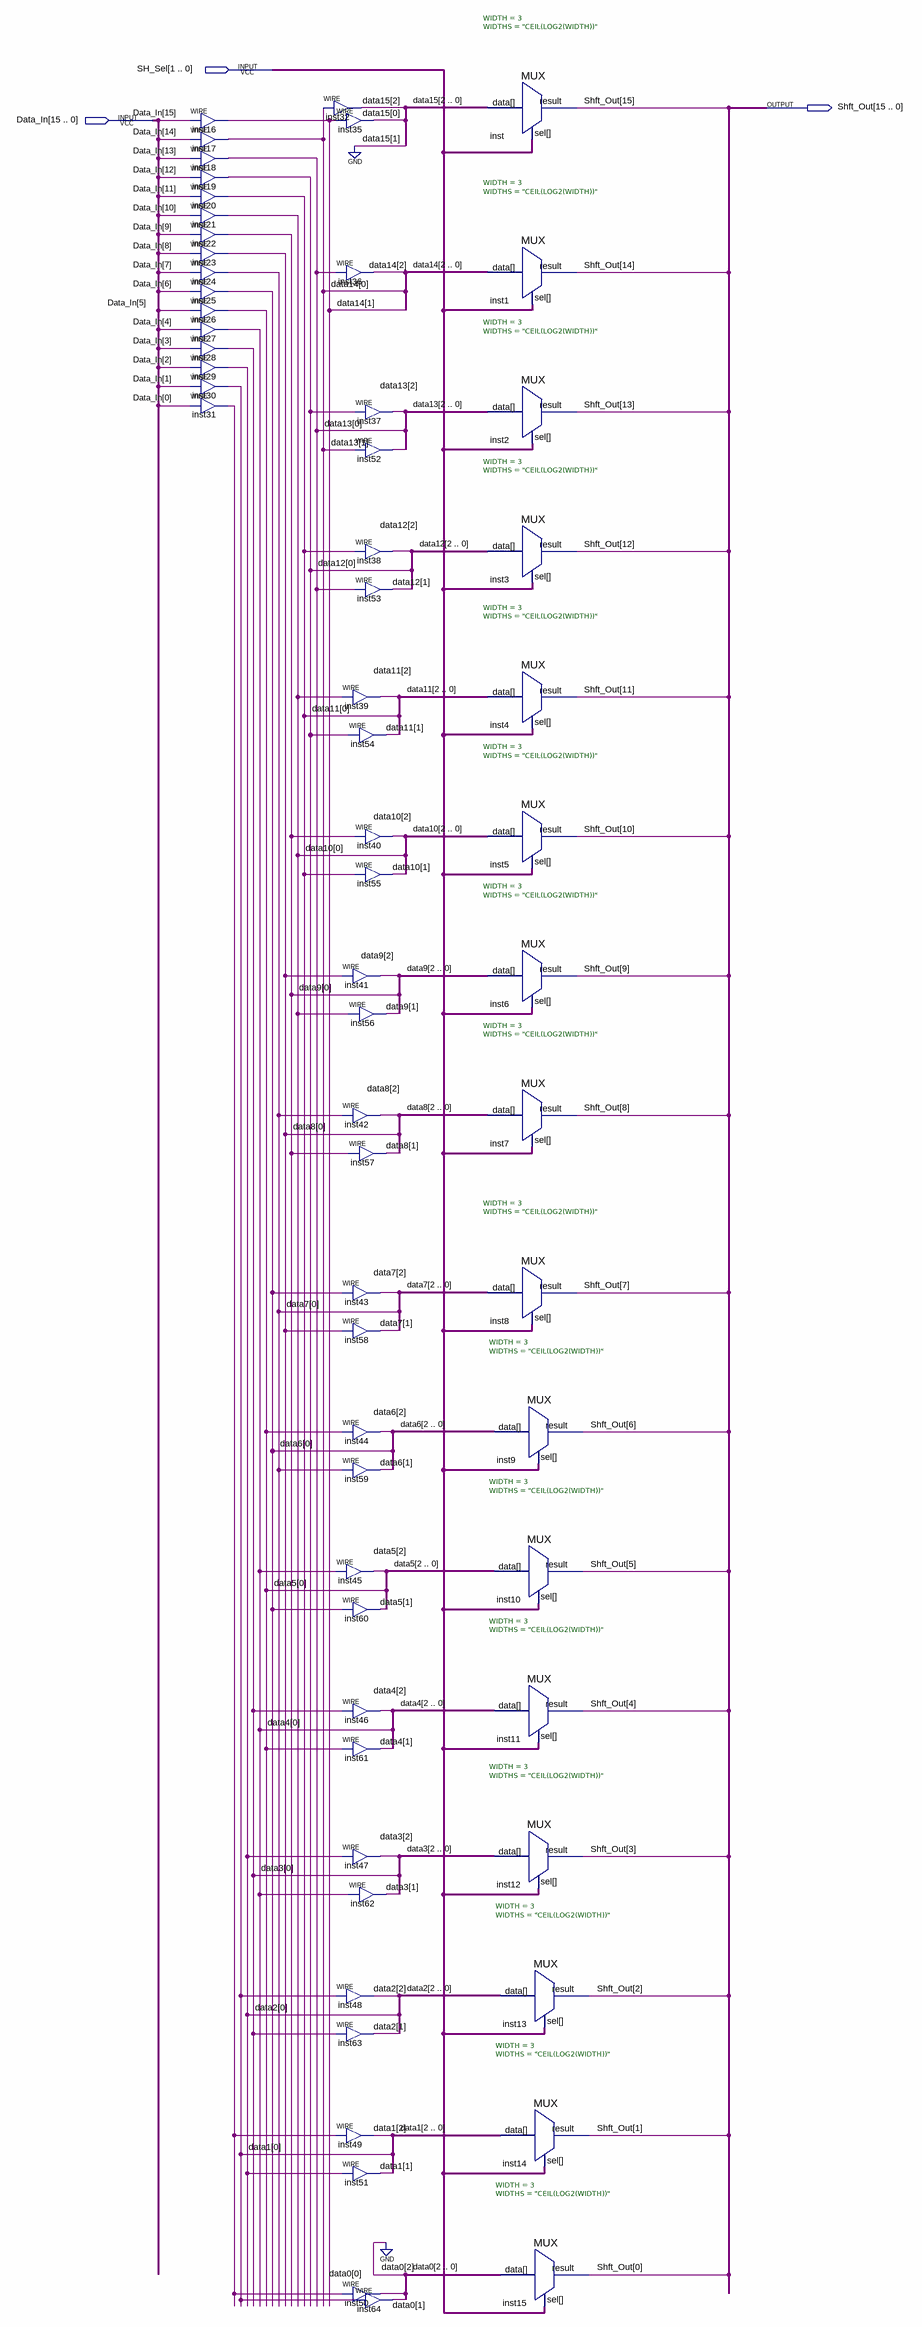
[diagram p0: schematic sheet]
// Quartus schematic Shifter.bdf as structural Verilog: 63 symbols, 3 pins
module Shifter (
  input  [1:0] SH_Sel,
  input  [15:0] Data_In,
  output [15:0] Shft_Out
);

  wire inst31_out;
  wire [1:0] data0;
  wire [2:0] data1, data2, data3, data4, data5, data6, data7, data8, data9, data10, data11, data12, data13,
       data14, data15;

  assign data14[1] = Data_In[15];  // WIRE inst16
  assign data14[0] = Data_In[14];  // WIRE inst17
  assign data13[0] = Data_In[13];  // WIRE inst18
  assign data12[0] = Data_In[12];  // WIRE inst19
  assign data11[0] = Data_In[11];  // WIRE inst20
  assign data10[0] = Data_In[10];  // WIRE inst21
  assign data9[0] = Data_In[9];  // WIRE inst22
  assign data8[0] = Data_In[8];  // WIRE inst23
  assign data7[0] = Data_In[7];  // WIRE inst24
  assign data6[0] = Data_In[6];  // WIRE inst25
  assign data5[0] = Data_In[5];  // WIRE inst26
  assign data4[0] = Data_In[4];  // WIRE inst27
  assign data3[0] = Data_In[3];  // WIRE inst28
  assign data2[0] = Data_In[2];  // WIRE inst29
  assign data1[0] = Data_In[1];  // WIRE inst30
  assign inst31_out = Data_In[0];  // WIRE inst31
  assign data15[2] = data14[0];  // WIRE inst32
  assign data15[0] = data14[1];  // WIRE inst35
  assign data14[2] = data13[0];  // WIRE inst36
  assign data5[2] = data4[0];  // WIRE inst45
  assign data2[2] = data1[0];  // WIRE inst48
  assign data2[1] = data3[0];  // WIRE inst63
  assign data1[2] = inst31_out;  // WIRE inst49
  assign data13[2] = data12[0];  // WIRE inst37
  assign data13[1] = data14[0];  // WIRE inst52
  assign data12[2] = data11[0];  // WIRE inst38
  assign data12[1] = data13[0];  // WIRE inst53
  assign data11[2] = data10[0];  // WIRE inst39
  assign data11[1] = data12[0];  // WIRE inst54
  assign data10[2] = data9[0];  // WIRE inst40
  assign data10[1] = data11[0];  // WIRE inst55
  assign data9[2] = data8[0];  // WIRE inst41
  assign data9[1] = data10[0];  // WIRE inst56
  assign data8[2] = data7[0];  // WIRE inst42
  assign data8[1] = data9[0];  // WIRE inst57
  assign data7[2] = data6[0];  // WIRE inst43
  assign data7[1] = data8[0];  // WIRE inst58
  assign data6[2] = data5[0];  // WIRE inst44
  assign data6[1] = data7[0];  // WIRE inst59
  assign data5[1] = data6[0];  // WIRE inst60
  assign data4[2] = data3[0];  // WIRE inst46
  assign data4[1] = data5[0];  // WIRE inst61
  assign data3[2] = data2[0];  // WIRE inst47
  assign data3[1] = data4[0];  // WIRE inst62
  assign data1[1] = data2[0];  // WIRE inst51
  assign data0[0] = inst31_out;  // WIRE inst50
  assign data0[1] = data1[0];  // WIRE inst64
  MUX #(.WIDTH(3), .WIDTHS("CEIL(LOG2(WIDTH))")) inst (
    .data({data15[2], 1'b0, data15[0]}), .sel(SH_Sel), .result(Shft_Out[15]));
  MUX #(.WIDTH(3), .WIDTHS("CEIL(LOG2(WIDTH))")) inst1 (.data(data14), .sel(SH_Sel), .result(Shft_Out[14]));
  MUX #(.WIDTH(3), .WIDTHS("CEIL(LOG2(WIDTH))")) inst2 (.data(data13), .sel(SH_Sel), .result(Shft_Out[13]));
  MUX #(.WIDTH(3), .WIDTHS("CEIL(LOG2(WIDTH))")) inst3 (.data(data12), .sel(SH_Sel), .result(Shft_Out[12]));
  MUX #(.WIDTH(3), .WIDTHS("CEIL(LOG2(WIDTH))")) inst4 (.data(data11), .sel(SH_Sel), .result(Shft_Out[11]));
  MUX #(.WIDTH(3), .WIDTHS("CEIL(LOG2(WIDTH))")) inst5 (.data(data10), .sel(SH_Sel), .result(Shft_Out[10]));
  MUX #(.WIDTH(3), .WIDTHS("CEIL(LOG2(WIDTH))")) inst6 (.data(data9), .sel(SH_Sel), .result(Shft_Out[9]));
  MUX #(.WIDTH(3), .WIDTHS("CEIL(LOG2(WIDTH))")) inst7 (.data(data8), .sel(SH_Sel), .result(Shft_Out[8]));
  MUX #(.WIDTH(3), .WIDTHS("CEIL(LOG2(WIDTH))")) inst8 (.data(data7), .sel(SH_Sel), .result(Shft_Out[7]));
  MUX #(.WIDTH(3), .WIDTHS("CEIL(LOG2(WIDTH))")) inst9 (.data(data6), .sel(SH_Sel), .result(Shft_Out[6]));
  MUX #(.WIDTH(3), .WIDTHS("CEIL(LOG2(WIDTH))")) inst10 (.data(data5), .sel(SH_Sel), .result(Shft_Out[5]));
  MUX #(.WIDTH(3), .WIDTHS("CEIL(LOG2(WIDTH))")) inst11 (.data(data4), .sel(SH_Sel), .result(Shft_Out[4]));
  MUX #(.WIDTH(3), .WIDTHS("CEIL(LOG2(WIDTH))")) inst12 (.data(data3), .sel(SH_Sel), .result(Shft_Out[3]));
  MUX #(.WIDTH(3), .WIDTHS("CEIL(LOG2(WIDTH))")) inst13 (.data(data2), .sel(SH_Sel), .result(Shft_Out[2]));
  MUX #(.WIDTH(3), .WIDTHS("CEIL(LOG2(WIDTH))")) inst14 (.data(data1), .sel(SH_Sel), .result(Shft_Out[1]));
  MUX #(.WIDTH(3), .WIDTHS("CEIL(LOG2(WIDTH))")) inst15 (.data({1'b0, data0}), .sel(SH_Sel), .result(Shft_Out[0]));
endmodule
